# Altium schematic sheet Ctrol2.SchDoc
size A4
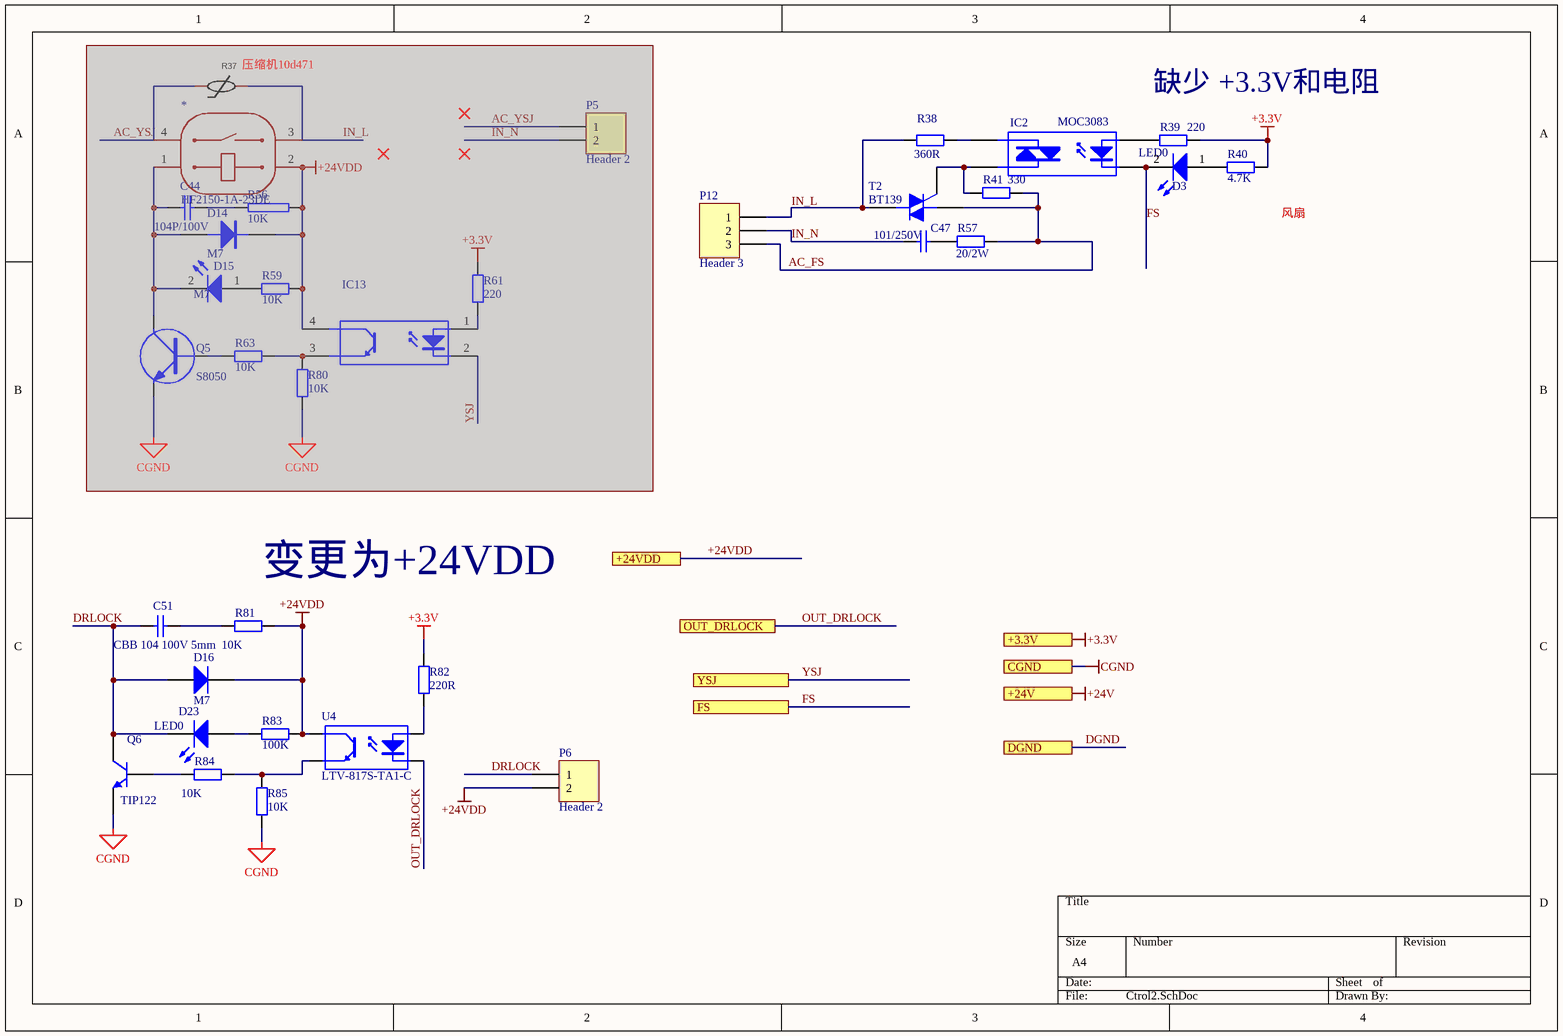
[diagram p0: Ctrol2.SchDoc]

## Parts
*  HF2150-1A-23DE  [JIDIANQI]  (masked out: inside a compile mask, not in the netlist)
C44  104P/100V  [CP1]  (masked out: inside a compile mask, not in the netlist)
C47  101/250V  [C6-7.62]
C51  CBB 104 100V 5mm  [CP1]
D3  LED0  [0805LED]
D14  M7  [SK24]  (masked out: inside a compile mask, not in the netlist)
D15  M7  [0805LED]  (masked out: inside a compile mask, not in the netlist)
D16  M7  [DO-214AC]
D23  LED0  [0805LED]
IC2  MOC3083  [DIP6]
IC13  (no value)  [TLV-356]  (masked out: inside a compile mask, not in the netlist)
P5  Header 2  [2P]  (masked out: inside a compile mask, not in the netlist)
P6  Header 2  [2P]
P12  Header 3  [CONN-TH_KF7.62-3p]
Q5  S8050  [SOT23]  (masked out: inside a compile mask, not in the netlist)
Q6  TIP122  [TO-220-AB]
R37  RM10D471KD14E100  [YAMINGDIANZU]  (value not drawn)  (masked out: inside a compile mask, not in the netlist)
R38  360R  [AXIAL0.4]
R39  220  [0805R]
R40  4.7K  [0805R]
R41  330  [AXIAL0.4]
R56  10K  [AXIAL0.4]  (masked out: inside a compile mask, not in the netlist)
R57  20/2W  [AXIAL0.6]
R59  10K  [0805R]  (masked out: inside a compile mask, not in the netlist)
R61  220  [0805R]  (masked out: inside a compile mask, not in the netlist)
R63  10K  [0805R]  (masked out: inside a compile mask, not in the netlist)
R80  10K  [0805R]  (masked out: inside a compile mask, not in the netlist)
R81  value 10K  [AXIAL0.4]  (hidden comment: 10K  1/2W)
R82  220R  [0805R]
R83  100K  [0805R]
R84  10K  [0805R]
R85  10K  [0805R]
T2  BT139  [TO220E]
U4  LTV-817S-TA1-C  [suo]

## Ports
+3.3V, +24V, +24VDD, CGND, DGND, FS, OUT_DRLOCK, YSJ

## Nets
+3.3V: R39.1 R40.2 R82.1 ; port +3.3V
+24V: port +24V
+24VDD: D16.2(K) P6.2 R81.2 R83.1 U4.4(C) ; port +24VDD
CGND: Q6.3(E) R85.2 ; port CGND
AC_FS: P12.3 R41.2 R57.2 T2.1(M1)
DGND: port DGND
DRLOCK: C51.2 D16.1(A) D23.2(K) P6.1 Q6.2(C)
FS: D3.2(K) IC2.2(K) ; port FS
IN_L: P12.1 R38.1 T2.2(M2)
IN_N: C47.1 P12.2
OUT_DRLOCK: U4.2(K) ; port OUT_DRLOCK
YSJ: port YSJ
NetC47_2: C47.2 R57.1
NetC51_1: C51.1 R81.1
NetD3_1: D3.1(A) R40.1
NetD23_1: D23.1(A) R83.2
NetIC2_1: IC2.1(A) R39.2
NetIC2_4: IC2.4(A/K) R41.1 T2.3(G)
NetIC2_6: IC2.6(A/K) R38.2
NetQ6_1: Q6.1(B) R84.1
NetR82_2: R82.2 U4.1(A)
NetR84_2: R84.2 R85.1 U4.3(E)

## Notes on the sheet
- (near R37) 压缩机10d471
- 缺少 +3.3V和电阻
- (near R40) 风扇
- (near R81) 变更为+24VDD

## Library data of the parts
C44 = CAP: Capacitor
C47 = CAP: 品牌： SHM(南方宏明) 型号： DCF101K26Y5PQ6BL7A0 等级：X1,Y2 容值：100pF 精度：±10% 电压(AC)：250V；400V 安规瓷介电容器 Y2 101 ±10% Y2 250VAC；100pF；±10%；Y5P；D=6.8max；CP线 0.55mm；引脚长20min.mm；直脚/直引线；引线间距7.5mm; Manufacturer: Generic Components; Class: Passive; SubClass: Capacitor; Published: 08/06/2000; Publisher: Altium Hobart Technology Centre
C51 = Cap: Capacitor; Published: 8-Jun-2000; LatestRevisionDate: 17-Jul-2002; LatestRevisionNote: Re-released for DXP Platform.; PackageReference: RAD-0.3; Publisher: Altium Limited; PackageDescription: Radial Cap, Thru-Hole; 2 Leads; 0.3 in Pin Spacing; Value: CBB 104 100V 5mm
D3 = LED1: 品牌： 国星光电 型号： NCD0805B2 发光颜色：蓝灯 贴片LED；0805蓝色；2012蓝色；透镜颜色：无色透明；发光角度：130°；功率：72mW；工作温度：-30℃~+85℃；; Manufacturer: Generic Components; Class: Optoelectronic; SubClass: LED; Published: 08/06/2000; Publisher: Altium Hobart Technology Centre
D14 = DIODE
D15 = LED1: Typical RED GaAs LED; Manufacturer: Generic Components; Class: Optoelectronic; Published: 08/06/2000; Publisher: Altium Hobart Technology Centre; SubClass: LED
D16 = Diode 1N4004: 1 Amp General Purpose Rectifier; Published: 8-Jun-2000; LatestRevisionDate: 17-Jul-2002; LatestRevisionNote: Re-released for DXP Platform.; DatasheetVersion: 1998; PackageVersion: Aug-1999; PackageReference: DO-41; Publisher: Altium Limited; PackageDescription: Diode, Axial; Body 5.2 x 2.7 mm (LxDia. max), Lead Dia. 0.86 mm (max); Code_JEDEC: DO-204-AL; ComponentLink1Description: Manufacturer Link; ComponentLink1URL: http://www.fairchildsemi.com/; ComponentLink2Description: Datasheet; ComponentLink2URL: http://www.fairchildsemi.com/ds/1N%2F1N4001.pdf
D23 = LED0: Typical INFRARED GaAs LED; Published: 8-Jun-2000; LatestRevisionDate: 08-Jul-2005; LatestRevisionNote: Mech Layer 1 removed.; PackageReference: LED-0; Publisher: Altium Limited; PackageDescription: LED; 2 Leads
IC2 = OPTOTRIAC: 品牌： LITEON(光宝)   型号： MOC3083     可控硅类型：双向可控硅 正向电压：1.2V 正向电流：50mA 断态峰值电压(Vdrm)：800V 静态dv/dt：1500V/us
IC13 = OPTOISO1: Optoisolator
P5 P6 = Header 2: DG141V-2.54-2P; LatestRevisionDate: 17-Jul-2002; LatestRevisionNote: Re-released for DXP Platform.; Publisher: Altium Limited
P12 = Header 3: 品牌： KEFA(科发)  KF7.62-3p隔板类型：两面 间距：7.62mm 结构：1x2P 每排PIN数：2 排数：1 安装方式：直针 引脚位置：边脚 额定电流：24A 额定电压：450V 线规 - AWG：12~22 线规 - mm2：2.5 工作温度范围：-40℃~+105℃ 颜色：黑色 黑色; LatestRevisionDate: 17-Jul-2002; LatestRevisionNote: Re-released for DXP Platform.; Publisher: Altium Limited
Q5 = NPN: NPN Transistor
Q6 = 2N3904: 描述 / 互补功率达林顿晶体管 / 品牌名称 / ST(意法半导体) / 商品型号 / TIP122 / 商品编号 / C16283 / 商品封装 / TO-220-3; Published: 8-Jun-2000; LatestRevisionDate: 15-Jan-2003; LatestRevisionNote: PCB Footprint 'BCY-W3/D4.7' replaced; DatasheetVersion: 1997; PackageVersion: Sep-1998; PackageReference: TO-92A; Publisher: Altium Limited; PackageDescription: TO, Flat Index; 3 In-Line, Axial Leads; Body Dia. 4.5mm; Leads 0.51 x 0.48 mm (max); ComponentLink1Description: Manufacturer Link; ComponentLink1URL: http://www.fairchildsemi.com/; ComponentLink2Description: Datasheet; ComponentLink2URL: http://www.fairchildsemi.com/ds/2N%2F2N3904.pdf
R37 = RM10D471KD14E100: Manufacturer: Dersonic(德尔创); Add into BOM: yes; Varistor Voltage: 470V; Clamping Voltage: 775V; Allowable Voltage (DC): 385V; Allowable Voltage (AC): 300V; Peak Current: 2.5kA; Maximum Energy: 67J; Typical Capatitance: 210pF@1kHz; Rated Wattage: 400mW; Symbol: RM10D471KD14E100; Device: RM10D471KD14E100; LCSC Part Name: 钳位电压775V 67焦耳 插件压敏电阻; Supplier Part: C2974809; Manufacturer Part: RM10D471KD14E100; Supplier Footprint: 插件,P=7.5mm; JLCPCB Part Class: Extended Part; Datasheet: https://atta.szlcsc.com/upload/public/pdf/source/20220216/7E2B8E32815A179BCD41409596CBB68C.pdf; Supplier: LCSC; Convert to PCB: yes
R38 = RES2: 品牌： UNI-ROYAL(厚声) 型号： MFR0W4F3600A50电阻类型：金属膜电阻 阻值：360Ω 精度：±1% 功率：250mW 温度系数：±50ppm/℃ 铜脚，圆柱状直插 1/4W; Manufacturer: Generic Components; Class: Passive; SubClass: Resistor; Published: 08/06/2000; Publisher: Altium Hobart Technology Centre
R39 = RES2: 品牌： UNI-ROYAL(厚声) 型号： 0805W8F1500T5E ：电阻类型：厚膜电阻 阻值：150Ω 精度：±1% 功率：125mW 温度系数：±100ppm/℃; Manufacturer: Generic Components; Class: Passive; SubClass: Resistor; Published: 08/06/2000; Publisher: Altium Hobart Technology Centre
R40 = RES2: 品牌： UNI-ROYAL(厚声) 型号： 0805W8F3301T5E  电阻类型：厚膜电阻 阻值：3.3kΩ 精度：±1% 功率：125mW 温度系数：±100ppm/℃; Manufacturer: Generic Components; Class: Passive; SubClass: Resistor; Published: 08/06/2000; Publisher: Altium Hobart Technology Centre
R41 = RES2: 品牌： UNI-ROYAL(厚声) 型号： MFR0W4F3300A50 电阻类型：金属膜电阻 阻值：330Ω 精度：±1% 功率：250mW 温度系数：±50ppm/℃ 铜脚，圆柱状直插 1/4W; Manufacturer: Generic Components; Class: Passive; SubClass: Resistor; Published: 08/06/2000; Publisher: Altium Hobart Technology Centre
R56 = RES2
R57 = RES2: 品牌： 华星机电 型号： MF2WS-20Ω±1%T 电阻类型：金属膜电阻 阻值：20Ω 精度：±1% 功率：2W 温度系数：±200ppm/℃; Manufacturer: Generic Components; Class: Passive; SubClass: Resistor; Published: 08/06/2000; Publisher: Altium Hobart Technology Centre
R59 R61 R63 R80 = RES2: Resistor; Manufacturer: Generic Components; Class: Passive; Published: 08/06/2000; Publisher: Altium Hobart Technology Centre; SubClass: Resistor
R81 R82 R84 R85 = Res2: Resistor; Published: 8-Jun-2000; LatestRevisionDate: 17-Jul-2002; LatestRevisionNote: Re-released for DXP Platform.; PackageReference: AXIAL-0.4; Publisher: Altium Limited; PackageDescription: Axial Device, Thru-Hole; 2 Leads; 0.4 in Pin Spacing
  R82: Value: 220R
  R84 R85: Value: 10K
R83 = Res2: 牌: UNI-ROYAL(厚声) / 封装: 0805 / 电阻类型: 厚膜电阻 / 阻值: 100kΩ / 精度: ±1% / 功率: 125mW; Published: 8-Jun-2000; LatestRevisionDate: 17-Jul-2002; LatestRevisionNote: Re-released for DXP Platform.; PackageReference: AXIAL-0.4; Publisher: Altium Limited; PackageDescription: Axial Device, Thru-Hole; 2 Leads; 0.4 in Pin Spacing; Value: 100K
T2 = Triac: 品牌：FUXINSEMI(富芯森美) 型号： BT139-600E; Manufacturer: Generic Components; Class: Discrete; Note: Pin 2 is electrically connected to Pin 4 (TAB); Published: 29/09/2000; SubClass: TRIAC
U4 = TLP781: 描述 / LTV817C 贴片光耦 光电耦合 / 品牌名称 / LITEON(光宝) / 商品型号 / LTV-817S-TA1-C / 商品编号 / C109227 / 商品封装 / SMD-4P